# Altium schematic sheet JETSON_RAW_PWR_FILTER.SchDoc
size A; SheetNumber: 11; SheetTotal: 11
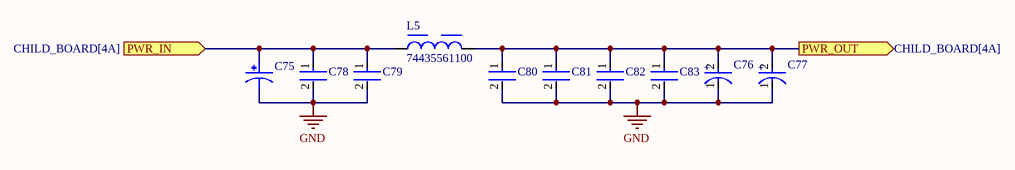
[diagram p0: JETSON_RAW_PWR_FILTER.SchDoc]

## Parts
C75  MAL215099913E3  [MAL215099913E3-Footprint-1]  (value not drawn)
C76  T491X107K025AT  [FP-T491X107K025AT-MFG]  (value not drawn)
C77  T491X107K025AT  [FP-T491X107K025AT-MFG]  (value not drawn)
C78  CGA9P3X7S2A156M250KB  [FP-CGA9P-IPC_B]  (value not drawn)
C79  CGA9P3X7S2A156M250KB  [FP-CGA9P-IPC_B]  (value not drawn)
C80  12103D106KAT2A  [FP-1210-L_3_3_0_4-W_2_5_0-MFG]  (value not drawn)
C81  12103D106KAT2A  [FP-1210-L_3_3_0_4-W_2_5_0-MFG]  (value not drawn)
C82  12103D106KAT2A  [FP-1210-L_3_3_0_4-W_2_5_0-MFG]  (value not drawn)
C83  12103D106KAT2A  [FP-1210-L_3_3_0_4-W_2_5_0-MFG]  (value not drawn)
L5  74435561100  [WE-HCI_1890]

## Ports
PWR_IN (in, see CHILD_BOARD[4A]), PWR_OUT (out, see CHILD_BOARD[4A])

## Nets
GND: C75.2 C76.1(C) C77.1(C) C78.2 C79.2 C80.2 C81.2 C82.2 C83.2
PWR_IN: C75.1 C78.1 C79.1 L5.1 ; port PWR_IN
PWR_OUT: C76.2(A) C77.2(A) C80.1 C81.1 C82.1 C83.1 L5.2 ; port PWR_OUT

## Notes on the sheet
- (in symbol CMP-2000-07204-2) +

## Library data of the parts
C75 = CMP-001-00064-1: Aluminum Electrolytic Capacitor, Polarized, Aluminum (wet), 100V, 20% +Tol, 20% -Tol, 470uF, Surface Mount, 7171; Value: 470µF; Capacitor Type: Aluminium; RoHS Compliant: Yes; Case/Package: 7171; Pins: 2; Max Operating Temperature: 105°C; Min Operating Temperature: -40°C
C76 C77 = CMP-2000-07204-2: CAP TANT 100UF 10% 25V 2917; Leakage Current: 25uA; Ripple Current: 742mA; Polarity: Polar; Dissipation Factor: 8%; Life (Hours): 2000Hour; Dielectric Material: Tantalum; ESR (Equivalent Series Resistance): 300mR; Length: 7.3mm; RoHS Compliant: No; Failure Rate: 0.001%; REACH SVHC: No SVHC; Tolerance: 10%; Mount: Surface Mount; Height - Seated (Max): 0.169inch; Features: General Purpose; Height: 4mm; Package Quantity: 1; Case Code (Metric): 7343; Max Operating Temperature: 125°C; Number of Pins: 2; Radiation Hardening: No; Lead Free: Lead Free; Capacitance: 100uF; Termination: SMD/SMT; Voltage Rating: 25V; Series: T491; Depth: 4.3mm; Construction: Flat; Case/Package: 2917; Min Operating Temperature: -55°C; Voltage Rating (DC): 25V; Width: 4.3mm; Packaging: Tape and Reel; Case Code (Imperial): 2917; Voltage: 25V
C78 C79 = CMP-2000-07446-2: Cap Ceramic 15uF 100V X7S 20% Pad SMD 2220 +125°C Automotive T/R; Thickness: 0.098inch; Weight: 0.016932oz; Depth: 5mm; Min Operating Temperature: -55°C; Composition: Ceramic; Voltage Rating: 100V; Capacitance: 15uF; Package Quantity: 1; Width: 0.197inch; Max Operating Temperature: 125°C; Voltage Rating (DC): 100V; Case Code (Metric): 5750; Tolerance: 20%; Length: 5.7mm; Height: 2.3mm; Mount: Surface Mount; Dielectric: X7S; Termination: SMD/SMT; Case/Package: 2220; Case Code (Imperial): 2220; Packaging: Tape and Reel; Lead Free: Lead Free; Ratings: AEC-Q200; REACH SVHC: No SVHC
C80-C83 = CMP-2000-05477-2: General Purpose Ceramic Capacitor, 1210, 10uF, 10%, X5R, 15%, 25V; Lead Free: Lead Free; Max Operating Temperature: 85°C; REACH SVHC: No SVHC; Depth: 2.5mm; Packaging: Tape and Reel; Min Operating Temperature: -55°C; Height: 2.29mm; Construction: Flat; Case Code (Imperial): 1210; Radiation Hardening: No; Voltage: 25V; Case/Package: 1210; Series: -; Dielectric: X5R; Length: 3.2mm; Thickness: 0.11inch; Package Quantity: 1; Termination: SMD/SMT; Case Code (Metric): 3225; Voltage Rating (DC): 25V; Voltage Rating: 25V; Contact Plating: Tin; RoHS Compliant: Yes; Mount: Surface Mount; Width: 0.098inch; Capacitance: 10uF; Tolerance: 10%
L5 = CMP-0226-00001-2: NexarPartId: 22803350; Inductance Tolerance: 20%; DC Resistance (DCR): 6.9mΩ; Inductance: 10µH; Saturation Current: 10A; Self Resonant Frequency: 14MHz; Width: 18.2mm; Packaging: Cut Tape (CT); Max Operating Temperature: 150°C; Number of Pins: 2; Length: 18.3mm; Min Operating Temperature: -40°C; RoHS: Compliant; Ambient Temperature Range Low: -40°C; Ambient Temperature Range High: 100°C; Height: 8.9mm